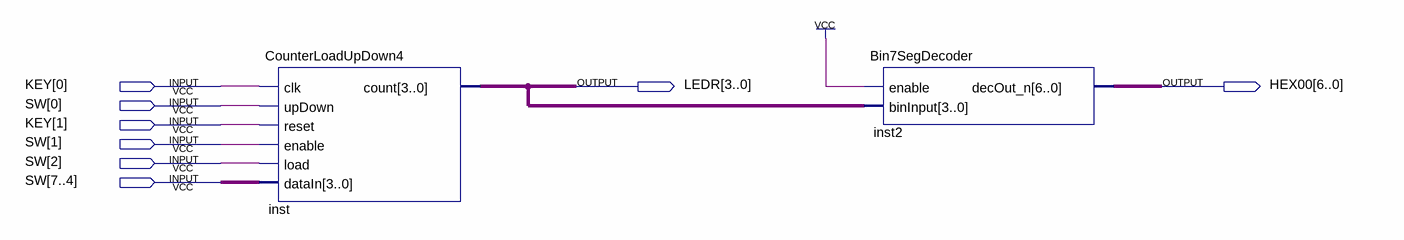
[diagram p0: schematic sheet]
// Quartus schematic Counter_Demo.bdf as structural Verilog: 2 symbols, 8 pins
module Counter_Demo (
  input  [1:0] KEY,
  input  [7:0] SW,
  output [3:0] LEDR,
  output [6:0] HEX00
);

  CounterLoadUpDown4 inst (
    .clk(KEY[0]), .upDown(SW[0]), .reset(KEY[1]), .enable(SW[1]), .load(SW[2]), .dataIn(SW[7:4]), .count(LEDR));
  Bin7SegDecoder inst2 (.enable(1'b1), .binInput(LEDR), .decOut_n(HEX00));
endmodule
